# EAGLE design ATTINY85 Updated Design (EAGLE 8.4.0)
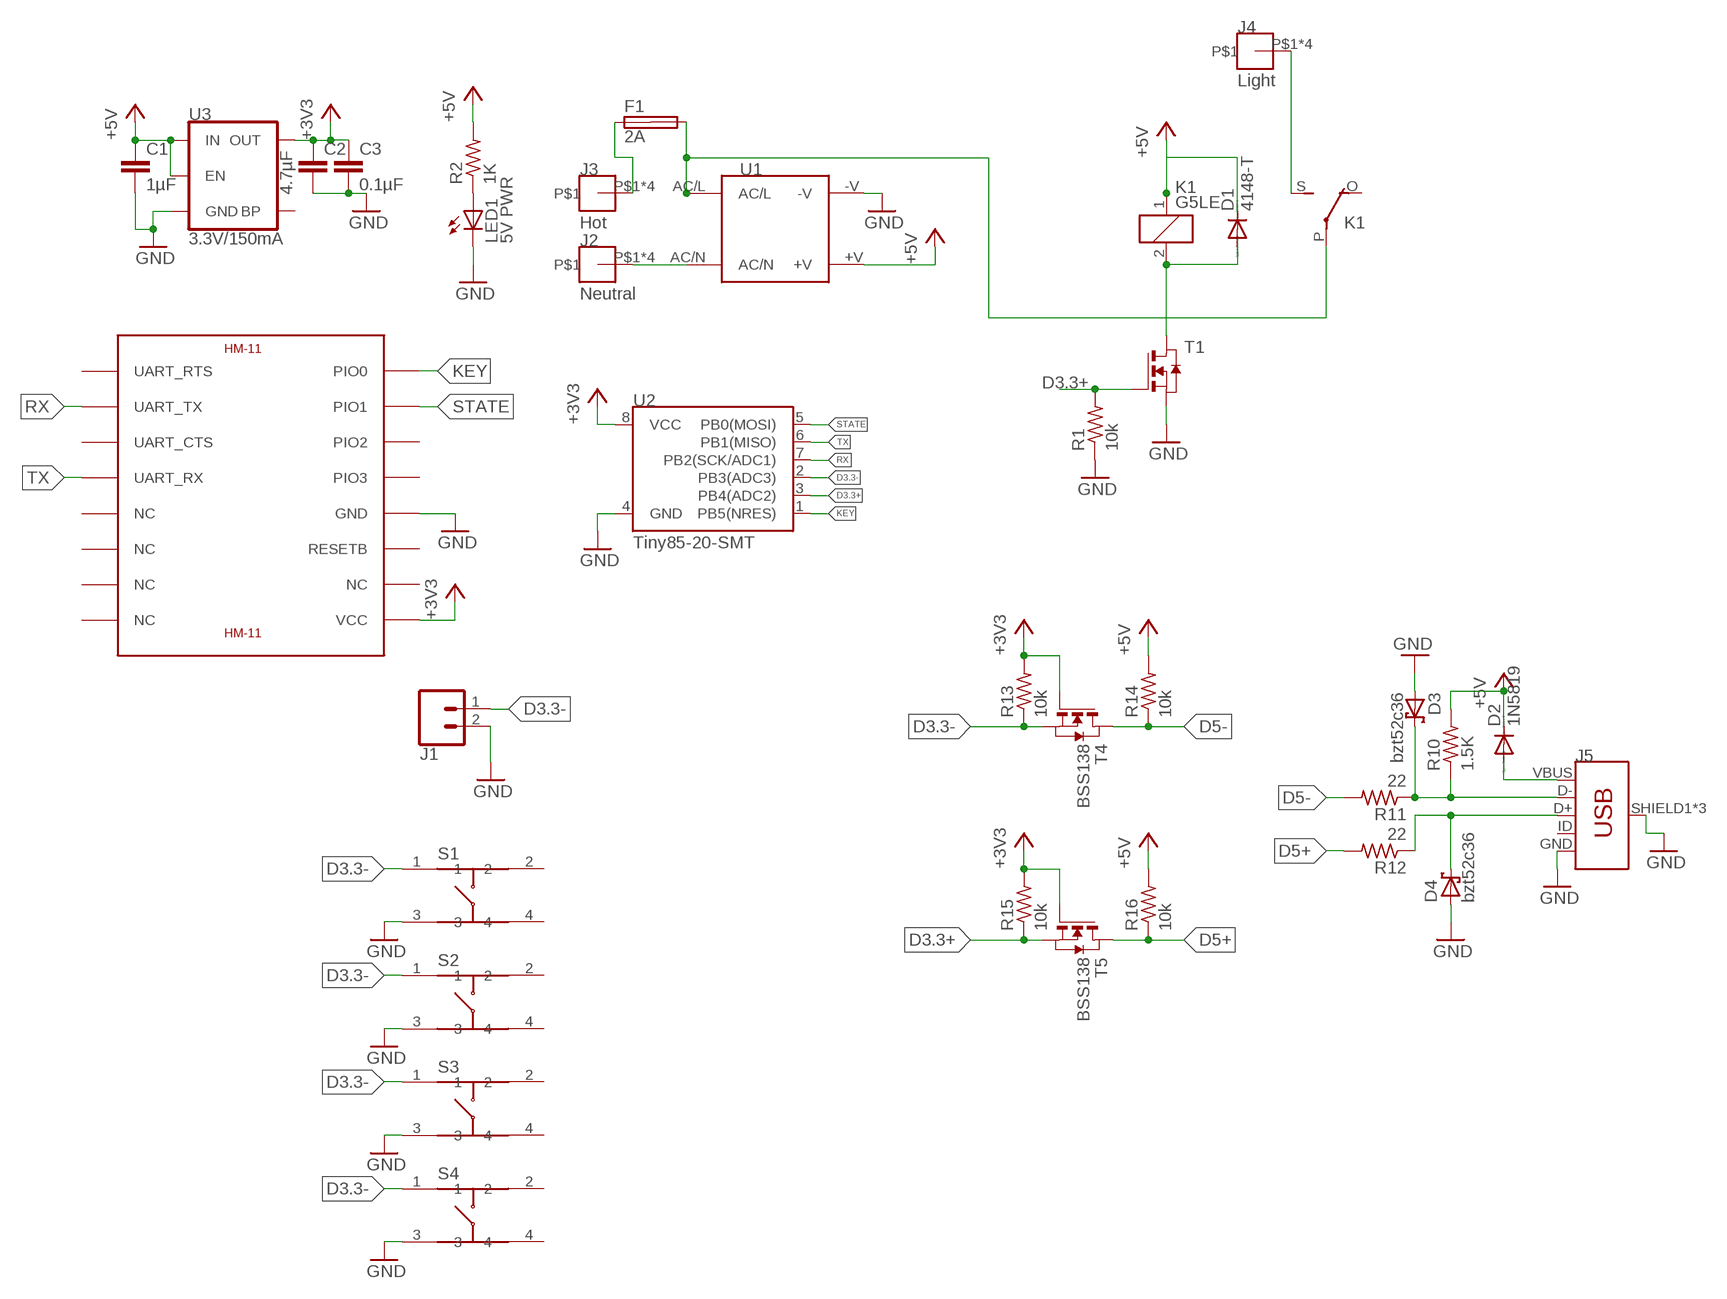
[diagram p0: schematic, sheet 1]

## Parts
C1  1µF  C-EUC0603K  [C0603K]
C2  4.7µF  C-EUC0603K  [C0603K]
C3  0.1µF  C-EUC0603K  [C0603K]
D1  4148-T  DIODE-SOD80C  [SOD80C]
D2  1N5819  DIODE-SOD323-R  [SOD323-R]
D3  bzt52c36  BAT60J  [SOD323_ST]
D4  bzt52c36  BAT60J  [SOD323_ST]
F1  2A  SHK20L  [SHK20L]
J1  CONN_025MM  [SCREWTERMINAL-5MM-2]
J2  Neutral  7700  [7700]
J3  Hot  7700  [7700]
J4  Light  7700  [7700]
J5  USB_MICRO-B_FEMALE-SMT  [USB-B-MICRO-SMD]
K1  G5LE  [G5LE]
LED1  5V PWR  LEDCHIPLED_0603  [CHIPLED_0603]
R1  10k  R-US_R0603  [R0603]
R2  1K  R-US_R0603  [R0603]
R10  1.5K  R-US_R0603  [R0603]
R11  22  R-US_R0603  [R0603]
R12  22  R-US_R0603  [R0603]
R13  10k  R-US_R0603  [R0603]
R14  10k  R-US_R0603  [R0603]
R15  10k  R-US_R0603  [R0603]
R16  10k  R-US_R0603  [R0603]
S1  PTS645S_SMTR92  [SMT]
S2  PTS645S_SMTR92  [SMT]
S3  PTS645S_SMTR92  [SMT]
S4  PTS645S_SMTR92  [SMT]
T1  NMOSSOT23  [SOT-23]
T4  BSS138  NMOSSOT23  [SOT-23]
T5  BSS138  NMOSSOT23  [SOT-23]
U1  IRM-05-5  [IRM-05]
U2  Tiny85-20-SMT  ATTINY45TINY85-20-SMT  [SO08-EIAJ_MCU]
U3  3.3V/150mA  V_REG_MIC52053.3V  [SOT23-5]
U$1  HM-11  [HM-11]

## Nets
+3V3: C2.1 C3.1 R13.2 R15.2 T4.3(G) T5.3(G) U2.8(VCC) U3.5(OUT) U$1.VCC
+5V: C1.1 D1.C D2.C K1.1 R2.2 R10.2 R14.2 R16.2 U1.+V U3.1(IN) U3.3(EN)
D3.3+: R1.2 R15.1 T1.3(G) T5.2(S) U2.3(PB4(ADC2))
D3.3-: J1.1 R13.1 S1.1 S2.1 S3.1 S4.1 T4.2(S) U2.2(PB3(ADC3))
D5+: R12.2 R16.1 T5.1(D)
D5-: R11.2 R14.1 T4.1(D)
GND: C1.2 C2.2 C3.2 D3.A D4.A J1.2 J5.GND J5.SHIELD1(SHIELD) J5.SHIELD2(SHIELD) J5.SHIELD3(SHIELD) LED1.C R1.1 S1.3 S2.3 S3.3 S4.3 T1.2(S) U1.-V U2.4(GND) U3.2(GND) U$1.GND
HOT [POWER]: F1.1A J3.P$1 J3.P$2 J3.P$3 J3.P$4
KEY: U2.1(PB5(NRES)) U$1.PIO0
LIGHT [POWER]: J4.P$1 J4.P$2 J4.P$3 J4.P$4 K1.S(2:S)
N$2: LED1.A R2.1
N$4 [POWER]: F1.2A K1.P(2:P) U1.AC/L
N$8: D1.A K1.2 T1.1(D)
N$16: D2.A J5.VBUS
N$17: D3.C J5.D- R10.1 R11.1
N$18: D4.C J5.D+ R12.1
NEUTRAL [POWER]: J2.P$1 J2.P$2 J2.P$3 J2.P$4 U1.AC/N
RX: U2.7(PB2(SCK/ADC1)) U$1.UART_TX
STATE: U2.5(PB0(MOSI)) U$1.PIO1
TX: U2.6(PB1(MISO)) U$1.UART_RX
Unconnected: F1.1B F1.2B J5.ID K1.O(2:O) S1.2 S1.4 S2.2 S2.4 S3.2 S3.4 S4.2 S4.4 U3.4(BP) U$1.NC@5(NC) U$1.NC@6(NC) U$1.NC@7(NC) U$1.NC@8(NC) U$1.NC@10(NC) U$1.PIO2 U$1.PIO3 U$1.RESETB U$1.UART_CTS U$1.UART_RTS

## Library data of the parts
C1-C3 = rcl:C-EU: CAPACITOR, European symbol
D1 D2 = diode:DIODE-: DIODE
D3 D4 = diode:BAT60J: Schottky barrier diode Source: www.st.com, BAT60J.pdf
F1 = fuse:SHK20L: FUSE HOLDER 5 x 20 mm, SH contact, SHH1 Schukat, E1073 Buerklin; OC_FARNELL: unknown; OC_NEWARK: unknown
J1 = SparkFun-Connectors:CONN_02: Multi connection point. Often used as Generic Header-pin footprint for 0.1 inch spaced/style header connections On any of the 0.1 inch spaced packages, you can populate with these: Break Away Headers - Straight <https://www.sparkfun.com/products/116> (PRT-00116) Break Away Male Headers - Right Angle <https://www.sparkfun.com/products/553> (PRT-00553) Female Headers <https://www.sparkfun.com/products/115> (PRT-00115) Break Away Headers - Machine Pin <https://www.sparkfun.com/products/117> (PRT-00117) Break Away Female Headers - Swiss Machine Pin <https://www.sparkfun.com/products/743> (PRT-00743) For SCREWTERMINALS and SPRING TERMINALS visit here: Screw Terimnals on SparkFun.com <https://www.sparkfun.com/search/results?term=Screw+Terminals> (5mm/3.5mm/2.54mm spacing) This device is also useful as a general connection point to wire up your design to another part of your project. Our various solder wires solder well into these plated through hole pads. Hook-Up Wire - Assortment (Stranded, 22 AWG) <https://www.sparkfun.com/products/11375> (PRT-11375) Hook-Up Wire - Assortment (Solid Core, 22 AWG) <https://www.sparkfun.com/products/11367> (PRT-11367) View the entire wire category on our website here <https://www.sparkfun.com/categories/141> Special notes: Molex polarized connector foot print use with: PRT-08233 with associated crimp pins and housings. 2.54_SCREWTERM for use with PRT-10571. 3.5mm Screw Terminal footprints for PRT-08084 5mm Screw Terminal footprints for use with PRT-08432; SF_SKU: PRT-08432
J2-J4 = Screw Terminal Keystone 7700:7700: 15A Screw Terminal Keystone 7700 <http://www.keyelco.com/product.cfm/Horizontal-Screw-Terminals/7700/product_id/1371>
J5 = SparkFun-Connectors_Custom_USB:USB_MICRO-B: USB Type Micro-B Connector Male/female and PTH/SMT variants SparkFun Products: SparkFun microB USB Breakout <https://www.sparkfun.com/products/12035> SparkFun USB microB Plug Breakout <https://www.sparkfun.com/products/10031> SparkFun ESP8266 Thing <https://www.sparkfun.com/products/13231>; PROD_ID: CONN-11752
K1 = relay:G5LE: RELAY 1 x switch, 10 A/120 V AC, 8 A/30 V DC, Omron; OC_FARNELL: unknown; OC_NEWARK: unknown
LED1 = led:LED: LED OSRAM: - CHIPLED LG R971, LG N971, LY N971, LG Q971, LY Q971, LO R971, LY R971 LH N974, LH R974 LS Q976, LO Q976, LY Q976 LO Q996 - Hyper CHIPLED LW Q18S LB Q993, LB Q99A, LB R99A - SideLED LS A670, LO A670, LY A670, LG A670, LP A670 LB A673, LV A673, LT A673, LW A673 LH A674 LY A675 LS A676, LA A676, LO A676, LY A676, LW A676 LS A679, LY A679, LG A679 - Hyper Micro SIDELED® LS Y876, LA Y876, LO Y876, LY Y876 LT Y87S - SmartLED LW L88C, LW L88S LB L89C, LB L89S, LG L890 LS L89K, LO L89K, LY L89K LS L896, LA L896, LO L896, LY L896 - TOPLED LS T670, LO T670, LY T670, LG T670, LP T670 LSG T670, LSP T670, LSY T670, LOP T670, LYG T670 LG T671, LOG T671, LSG T671 LB T673, LV T673, LT T673, LW T673 LH T674 LS T676, LA T676, LO T676, LY T676, LB T676, LH T676, LSB T676, LW T676 LB T67C, LV T67C, LT T67C, LS T67K, LO T67K, LY T67K, LW E67C LS E67B, LA E67B, LO E67B, LY E67B, LB E67C, LV E67C, LT E67C LW T67C LS T679, LY T679, LG T679 LS T770, LO T770, LY T770, LG T770, LP T770 LB T773, LV T773, LT T773, LW T773 LH T774 LS E675, LA E675, LY E675, LS T675 LS T776, LA T776, LO T776, LY T776, LB T776 LHGB T686 LT T68C, LB T68C - Hyper Mini TOPLED® LB M676 - Mini TOPLED Santana® LG M470 LS M47K, LO M47K, LY M47K Source: http://www.osram.convergy.de LUXEON: - LUMILED® LXK2-PW12-R00, LXK2-PW12-S00, LXK2-PW14-U00, LXK2-PW14-V00 LXK2-PM12-R00, LXK2-PM12-S00, LXK2-PM14-U00 LXK2-PE12-Q00, LXK2-PE12-R00, LXK2-PE12-S00, LXK2-PE14-T00, LXK2-PE14-U00 LXK2-PB12-K00, LXK2-PB12-L00, LXK2-PB12-M00, LXK2-PB14-N00, LXK2-PB14-P00, LXK2-PB14-Q00 LXK2-PR12-L00, LXK2-PR12-M00, LXK2-PR14-Q00, LXK2-PR14-R00 LXK2-PD12-Q00, LXK2-PD12-R00, LXK2-PD12-S00 LXK2-PH12-R00, LXK2-PH12-S00 LXK2-PL12-P00, LXK2-PL12-Q00, LXK2-PL12-R00 Source: www.luxeon.com KINGBRIGHT: KA-3528ASYC Source: www.kingbright.com
R1 R2 R10-R16 = resistor:R-US_: RESISTOR, American symbol
S1-S4 = PTS645 Series Tactile Switches:PTS645S_SMTR92: Surface Mount PTS645 Series Switch Datasheet <http://www.mouser.com/ds/2/60/-1131575.pdf>
T1 T4 T5 = zetex:NMOSSOT23: MOS FET; OC_FARNELL: unknown; OC_NEWARK: unknown
U1 = IRM-05:IRM-05-5: IRM-05-5 AC to 5VDC Specifications: Manufacturer: Mean Well Input Voltage: 85~264 VAC 120~370 VDC Input Frequency: 47~440 Hz Output Voltage: 5 V Output Current: 1 A IRM-05 Datasheet <http://www.mouser.com/ds/2/260/IRM-05-SPEC-806200.pdf>
U2 = SparkFun-Retired:ATTINY45: Atmel 8-pin 2/4/8kB flash uC Retired; PROD_ID: IC-09092
U3 = SparkFun-IC-Power:V_REG_MIC5205: V_REG MIC5205 Standard 3.3V, 5V, and Adjustable 150mA LDO voltage regulator in SOT-23 layout. Micrel part MIC5205. BP (by-pass) pin is used to lower output noise with 470pF cap, may be left open. On the adjustable version BP is used to set output.; PROD_ID: VREG-00822
U$1 = hm-11:HM-11: JNHuaMao HM-11 Bluetooth 4.0 Transceiver based on TI CC2540/CC2541

## Net classes
0 default: clearance 0.152 mm
1 POWER: width 1.397 mm, clearance 1.27 mm

## Board
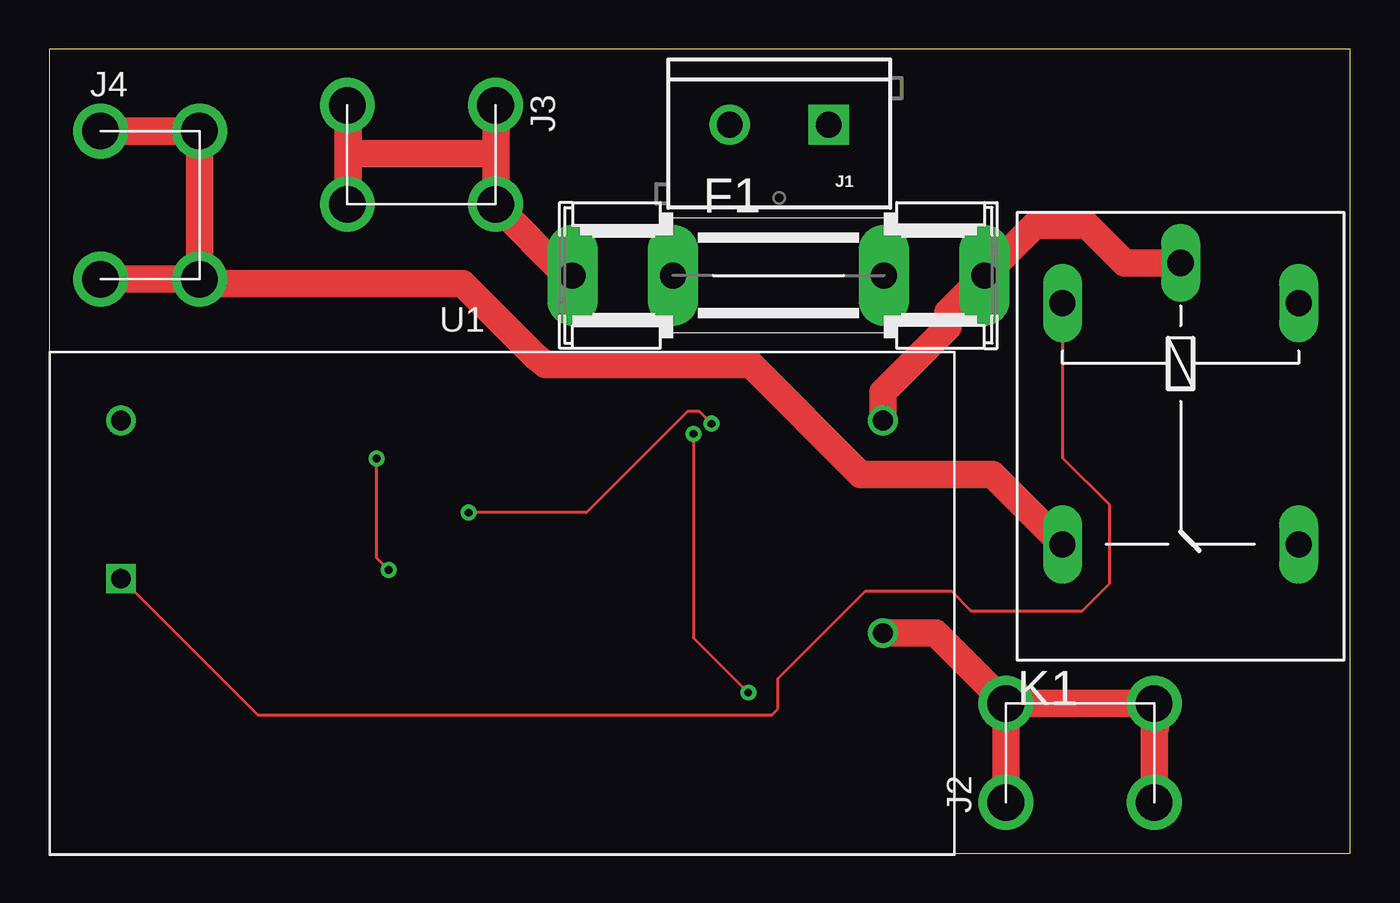
[diagram p1: board, top side]
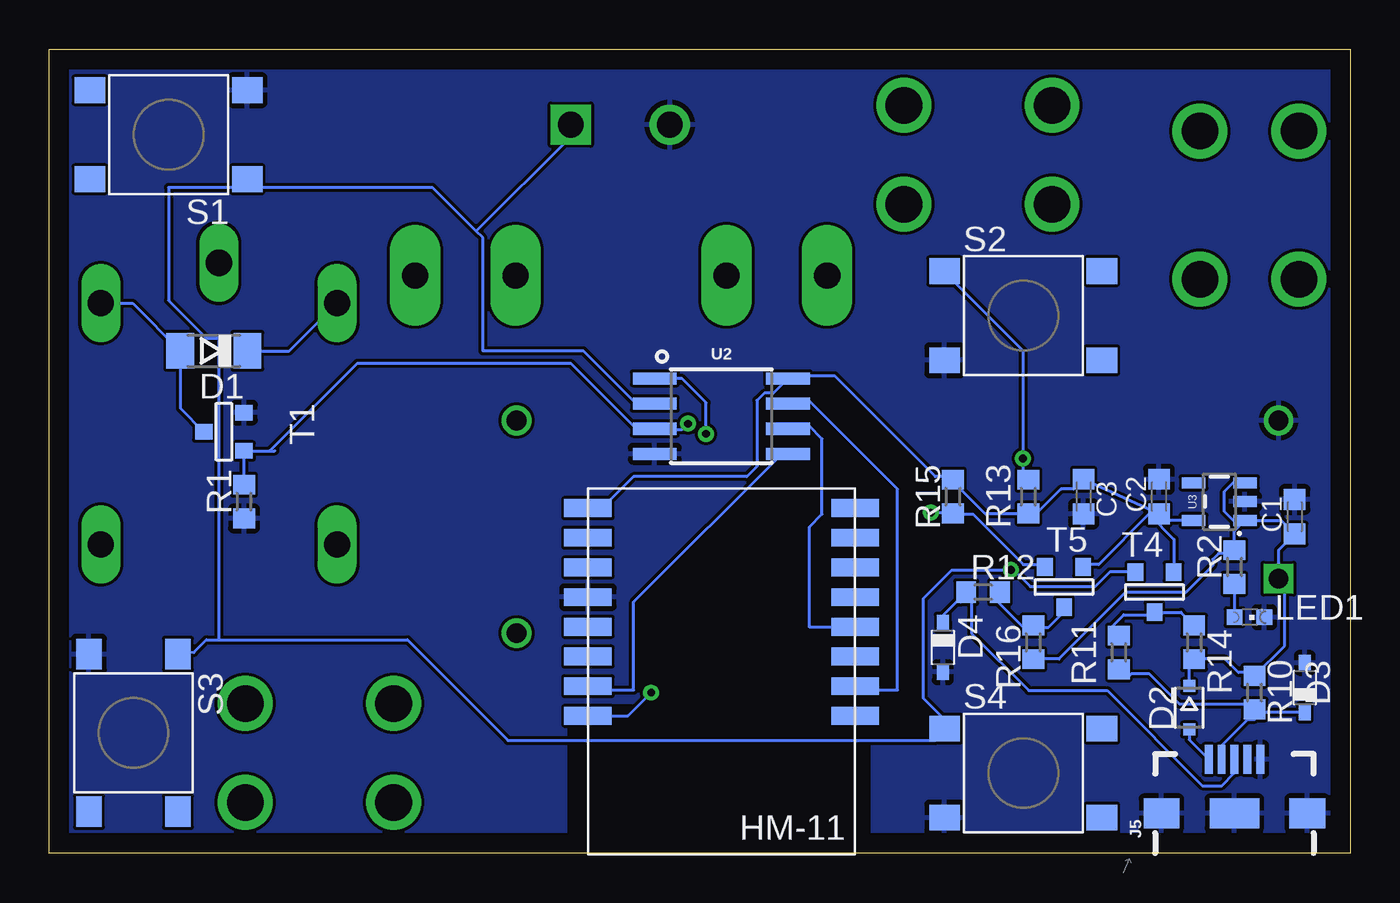
[diagram p2: board, bottom side, seen from below]

Size 65.71 x 40.63 mm. Coordinates in mm from the lower left corner, seen from the top.
Outline: 0,0 65.71,0 65.71,40.63 0,40.63 0,0
Copper layers (1*16): Top 0.035mm / dielectric 1.5mm / Bottom 0.035mm
Design rules "default *": minimum track width 6mil, minimum drill 0.4mm, track to track 6mil, track to pad 6mil, pad to pad 6mil, via to via 6mil, smd to smd 6mil, copper to edge 40mil, drill to drill 6mil, minimum pad ring 10mil, minimum via ring 8mil, stop-mask expansion 4mil, vias tented up to drill 0mil, thermal gap 10mil

### Footprints (pad centres in the part's own frame; a part is rotated, then mirrored left to right if it is on the bottom)
C0603K = smd 1.05 x 1.08: 1 -0.875,0; 2 0.875,0
SOD80C = smd 1.4 x 1.8: A 1.7,0; C -1.7,0
SOD323-R = smd 0.6 x 0.6: A 1.1,0; C -1.1,0
SOD323_ST = smd 0.8 x 0.6: A 1.25,0; C -1.25,0
SHK20L = drill 1.321 pad 2.54 long: 1A -10.414,0; 1B -5.334,0; 2A 10.414,0; 2B 5.334,0
SCREWTERMINAL-5MM-2 = drill 1.3 pad 2.032 square: 1 0,0 | drill 1.3 pad 2.032: 2 5,0
7700 = drill 1.85: P$1 -2.5,3.745; P$2 2.5,3.745; P$3 -2.5,-3.745; P$4 2.5,-3.745
USB-B-MICRO-SMD = smd 1.45 x 0.4: D+ 2.725,0; D- 2.725,0.65; GND 2.725,-1.3; ID 2.725,-0.65; VBUS 2.725,1.3 | smd 1.5 x 1.8: SHIELD1 0,3.685; SHIELD2 0,-3.685 | smd 1.5 x 2.5: SHIELD3 0,0
G5LE = drill 1.321 long: 1 -7.493,-5.969; 2 -7.493,5.969; O 4.699,5.969; P -9.525,0; S 4.699,-5.969
CHIPLED_0603 = smd 0.8 x 0.8: A 0,-0.75; C 0,0.75
R0603 = smd 1 x 1.1: 1 -0.85,0; 2 0.85,0
SMT = smd 1.55 x 1.3: 1 -3.975,2.25; 2 3.975,2.25; 3 -3.975,-2.25; 4 3.975,-2.25
SOT-23 = smd 0.787 x 0.889: 1 0.025,-1.016; 2 -0.94,1.016; 3 0.991,1.016
IRM-05 = drill 1 square: +V -19.25,-2.625 | drill 1: -V -19.25,5.375; AC/L 19.25,5.375; AC/N 19.25,-5.375
SO08-EIAJ_MCU = smd 0.61 x 2.21: 1 -1.905,-3.378; 2 -0.635,-3.378; 3 0.635,-3.378; 4 1.905,-3.378; 5 1.905,3.353; 6 0.635,3.353; 7 -0.635,3.353; 8 -1.905,3.353
SOT23-5 = smd 0.55 x 1.2: 1 -0.95,-1.3; 2 0,-1.3; 3 0.95,-1.3; 4 0.95,1.3; 5 -0.95,1.3
HM-11 = smd 2.4 x 0.9: GND 6.5,0; NC@5 -7,0; NC@6 -7,-1.5; NC@7 -7,-3; NC@8 -7,-4.5; NC@10 6.5,-3; PIO0 6.5,6; PIO1 6.5,4.5; PIO2 6.5,3; PIO3 6.5,1.5; RESETB 6.5,-1.5; UART_CTS -7,3; UART_RTS -7,6; UART_RX -7,1.5; UART_TX -7,4.5; VCC 6.5,-4.5

### Placement (x,y rotation side)
C1  2.79,17.02 90 bottom
C2  9.65,18.03 90 bottom
C3  13.46,18.03 270 bottom
D1  57.4,25.4 180 bottom
D2  8.13,7.37 270 bottom
D3  2.29,8.38 90 bottom
D4  20.57,10.41 270 bottom
F1  36.83,29.21 0 top
J1  39.37,36.83 180 top
J2  52.07,5.08 90 top
J3  18.8,35.31 270 top
J4  5.08,32.77 0 top
J5  5.84,2.03 90 bottom
K1  57.15,20.32 270 top
LED1  5.08,11.94 270 bottom
R1  55.88,17.78 90 bottom
R2  5.84,14.48 90 bottom
R10  4.83,8.13 90 bottom
R11  11.68,10.16 90 bottom
R12  18.54,13.21 0 bottom
R13  16.26,18.03 270 bottom
R14  7.87,10.67 270 bottom
R15  20.07,18.03 90 bottom
R16  16,10.67 270 bottom
S1  59.69,36.32 180 bottom
S2  16.51,27.18 0 bottom
S3  61.47,6.1 270 bottom
S4  16.51,4.06 0 bottom
T1  56.9,21.34 270 bottom
T4  9.91,13.21 0 bottom
T5  14.48,13.46 0 bottom
U1  22.86,16.51 0 top
U2  31.75,22.1 270 bottom
U3  6.6,17.78 90 bottom
U$1  32,12.95 180 bottom

### Tracks (layer width: path | path; a pad name or v marks a point on that pad's centre or on a via)
+3V3
  Bottom 0.152: U3.5 9.32,16.83 C2.1 | C2.1 C3.1 13.97,18.41 14.61,18.41 15.88,17.14 R13.2 16.51,17.14 18.41,17.14 19.68,18.41 R15.2 20.32,19.05 20.95,19.05 26.04,24.13 27.94,24.13 U2.8 | 10.16,17.14 8.89,15.88 8.89,14.61 T4.3 | 10.16,17.14 12.7,14.61 13.34,14.61 T5.3 | 10.16,17.14 C2.1 | 29.21,24.13 28.57,24.13 U2.8 | U$1.VCC 38.1,17.78 37.47,17.78 36.2,19.05 30.48,19.05 29.97,19.56 29.97,22.89 29.6,23.27 29.13,23.27 U2.8
+5V
  Top 0.152: K1.1 51.21,27.81 51.21,19.96 53.57,17.6 53.57,13.64 52.2,12.27 46.56,12.27 45.57,13.26 41.22,13.26 36.8,8.84 36.8,7.32 36.5,7.01 10.52,7.01 3.66,13.87 U1.+V
  Bottom 0.152: D1.C 53.59,25.4 K1.1 | U3.1 3.48,16.83 C1.1 3.61,15.33 U1.+V 3.3,13.58 3.3,10.5 R10.2 4.88,8.99 5.03,9.14 5.64,9.14 6.33,9.83 7.85,9.83 R14.2 7.92,9.75 8.15,9.53 8.15,8.53 D2.C | U3.1 5.91,16.83 6.35,17.27 6.35,18.29 5.84,18.8 5.37,18.8 U3.3 | U3.1 5.84,16.29 R2.2 5.87,15.32 6.02,15.16 6.63,15.16 6.93,14.86 6.93,14.55 8.31,13.18 11.35,13.18 14.71,9.83 R16.2
D3.3+  (via drill 0.4)
  Top 0.152: v21.18,17.22 27.13,17.22 32.23,22.33 32.84,22.33 v33.45,21.72
  Bottom 0.152: R1.2 T1.3 54.61,20.34 | 54.61,20.34 54.33,20.34 | T5.2 15.24,14.61 16.51,14.61 19.05,17.14 19.68,17.14 R15.1 20.12,17.22 v21.18,17.22 | 36.2,21.59 39.37,24.77 50.16,24.77 54.61,20.32 54.61,20.34 | 36.2,21.59 35.56,21.59 U2.3 | 36.2,21.59 U2.3 | v33.45,21.72 33.76,21.41 35.13,21.41 U2.3
D3.3-  (via drill 0.4)
  Top 0.152: v16.54,19.96 16.54,14.94 v17.14,14.33
  Bottom 0.152: 57.15,10.79 57.78,10.79 58.42,10.16 S3.1 | 57.15,10.79 47.62,10.79 42.55,5.71 20.95,5.71 S4.1 20.5,6.33 20.5,6.78 21.57,7.85 21.57,12.88 20.12,14.33 v17.14,14.33 17.07,14.4 16.15,13.49 12.88,13.49 12.12,14.25 10.9,14.25 T4.2 10.79,14.29 | 16.51,19.96 16.51,19.05 R13.1 | 16.51,19.96 16.51,25.4 20.32,29.21 S2.1 | 44.15,31.45 43.81,31.11 43.81,25.4 38.73,25.4 36.2,22.86 35.56,22.86 U2.2 34.92,22.86 | 44.15,31.45 46.35,33.66 55.24,33.66 S1.1 55.88,33.66 59.69,33.66 59.69,27.94 57.78,26.04 57.15,26.04 57.15,10.79 | 44.15,31.45 39.4,36.2 39.4,36.8 J1.1 | v16.54,19.96 16.51,19.96
D5+
  Bottom 0.152: T5.1 14.61,12.06 15.24,11.43 15.88,11.43 R16.1 16.51,11.43 17.78,12.7 R12.2
D5-
  Bottom 0.152: T4.1 10.16,12.06 11.43,12.06 12.06,11.43 R11.2 | 7.62,11.43 R14.1 8.55,12.19 T4.1 | 9.53,12.06 T4.1
GND
  pour Bottom: 67.56,41.91 0,41.91 -1.52,40.39 -1.52,-0.25 -0.25,-1.52 23.88,-1.52 24.13,-1.27 24.13,7.62 39.37,7.62 39.62,7.37 39.62,-1.27 59.94,-1.27 66.04,-1.27 67.06,-0.25 67.56,-0.25 68.58,0.76 68.58,41.4 68.07,41.4
HOT
  Top 1.397: 15.09,35.36 15.09,37.8 J3.P$3 | 15.09,35.36 15.09,32.84 J3.P$4 | F1.1A 26.36,29.26 26.06,29.26 22.55,32.77 J3.P$2 22.55,33.45 22.55,35.36 | 22.55,35.36 22.55,37.8 J3.P$1 | 22.55,35.36 15.09,35.36
KEY  (via drill 0.4)
  Top 0.152: v35.31,8.13 32.54,10.9 v32.54,21.21
  Bottom 0.152: 38.1,6.99 U$1.PIO0 36.48,6.95 v35.31,8.13 | U2.1 33.76,24 32.54,22.78 v32.54,21.21
LIGHT
  Top 1.397: J4.P$4 J4.P$3 | J4.P$1 J4.P$2 J4.P$4 | K1.S 47.64,19.16 40.98,19.16 35.44,24.7 25.07,24.7 24.54,25.15 20.88,28.8 8.23,28.8 J4.P$4
N$2
  Bottom 0.152: LED1.A 5.83,13.62 R2.1
N$4
  Top 1.397: U1.AC/L 42.11,23.31 45.4,26.6 45.4,27.37 F1.2A 49.8,31.76 52.41,31.76 54.32,29.84 K1.P
N$8
  Bottom 0.152: K1.2 61.52,27.81 D1.A 59.1,22.5 T1.1
N$16
  Bottom 0.152: D2.A 8.13,5.74 J5.VBUS
N$17
  Bottom 0.152: 11.43,8.89 R11.1 11.43,8.99 11.12,8.99 11.05,9.07 10.13,9.07 8.61,7.54 5.11,7.54 4.88,7.32 R10.1 | D3.C 2.29,7.16 4.72,7.16 4.8,7.24 R10.1 | R10.1 4.8,7.16 4.8,6.78 5.16,6.78 6.49,5.45 J5.D-
N$18
  Bottom 0.152: D4.C 20.55,11.66 20.32,11.43 D4.C | D4.C 20.34,11.66 | R12.1 19.68,12.7 | D4.C 20.57,12.03 R12.1 | R12.1 19.43,13.03 19.13,12.72 19.13,11.12 16.23,8.23 12.27,8.23 7.47,3.43 6.48,3.43 5.84,4.06 J5.D+
NEUTRAL
  Top 1.397: J2.P$2 44.77,11.13 U1.AC/N | J2.P$2 J2.P$4 55.88,7.51 55.88,6.35 55.81,6.29 J2.P$3 | J2.P$1 J2.P$2
RX
  Bottom 0.152: U2.7 27.94,22.86 27.3,22.86 22.86,18.41 22.86,8.26 24.77,8.26 U$1.UART_TX
STATE
  Bottom 0.152: U2.5 28.57,20.32 36.2,12.7 36.2,8.26 38.1,8.26 U$1.PIO1
TX
  Bottom 0.152: U2.6 27.94,21.59 27.3,21.59 26.67,20.95 26.67,17.14 27.3,16.51 27.3,11.43 25.4,11.43 U$1.UART_RX